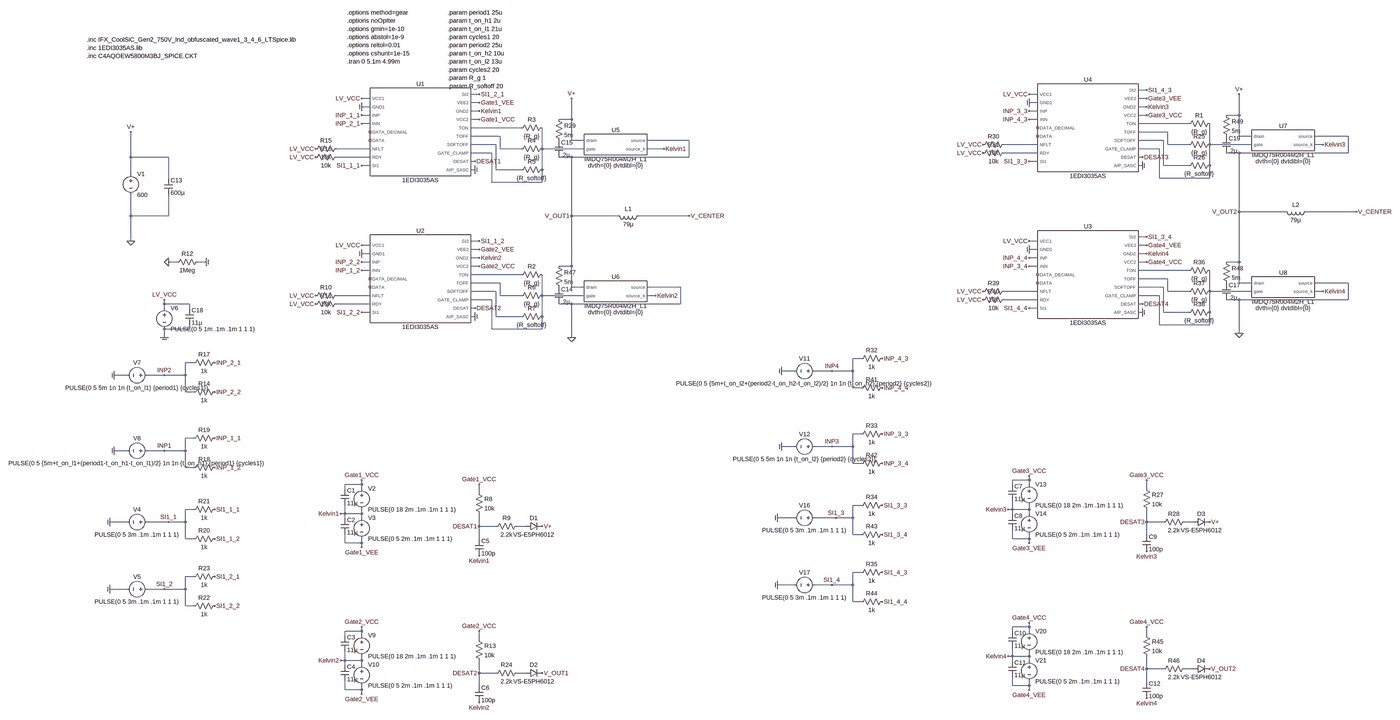
[diagram p0: schematic Dual Half Bridge Sim.asc, whole sheet]
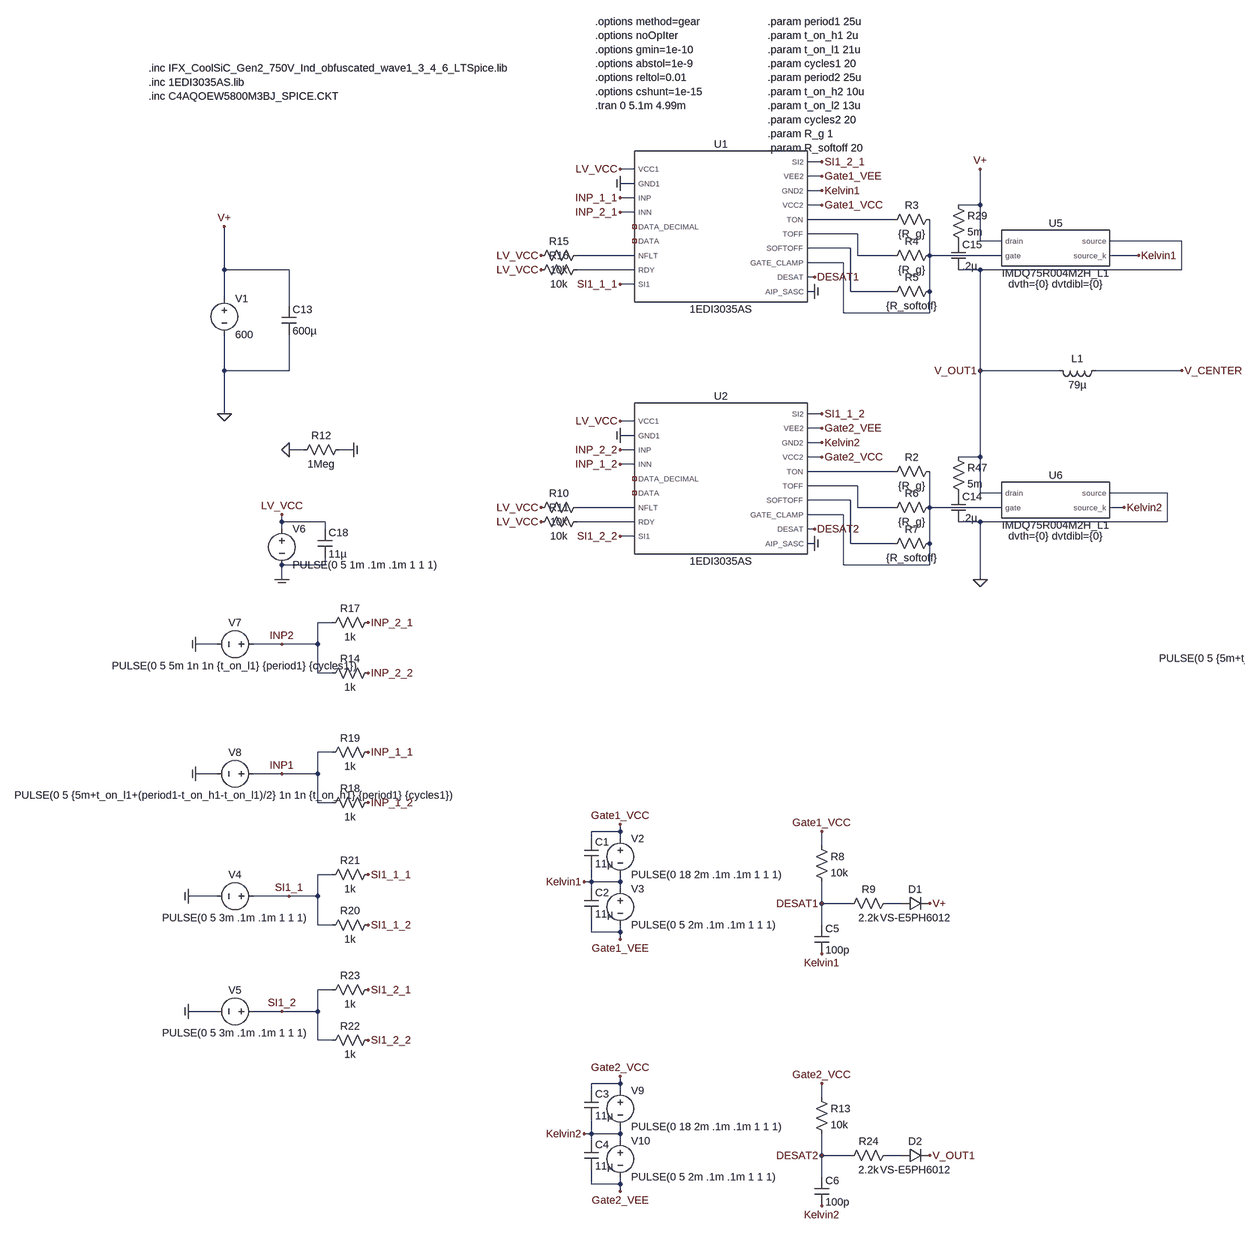
[diagram p1: schematic Dual Half Bridge Sim.asc, part, row 1 of 1, column 1 of 2]
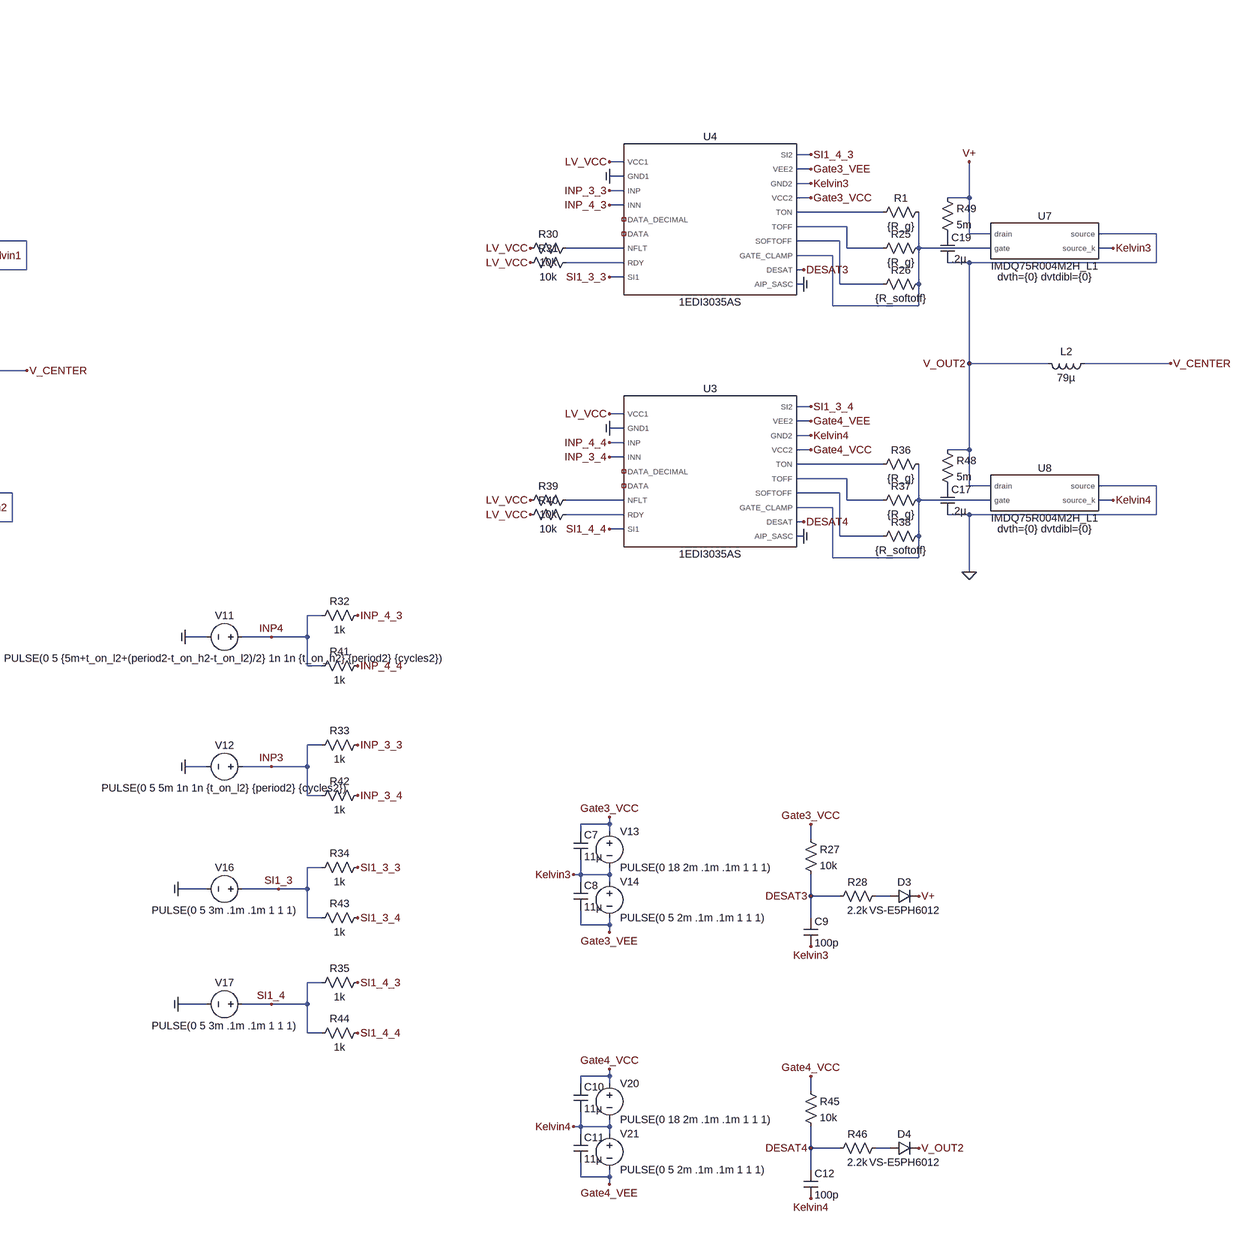
[diagram p2: schematic Dual Half Bridge Sim.asc, part, row 1 of 1, column 2 of 2]
Dual Half Bridge Sim.asc, the LTspice schematic file:
Version 4.1
SHEET 1 4068 2412
WIRE 3040 -64 3008 -64
WIRE 496 -48 464 -48
WIRE 2624 -48 2592 -48
WIRE 80 -32 48 -32
WIRE 3040 -32 3008 -32
WIRE 496 -16 464 -16
WIRE 2624 -16 2592 -16
WIRE 80 0 48 0
WIRE 3040 0 3008 0
WIRE 496 16 464 16
WIRE 2624 16 2592 16
WIRE 80 32 48 32
WIRE 3040 32 3008 32
WIRE 3392 32 3392 -48
WIRE 3392 32 3344 32
WIRE 496 48 464 48
WIRE 848 48 848 -32
WIRE 848 48 800 48
WIRE 2624 48 2592 48
WIRE 80 64 48 64
WIRE 3200 64 3008 64
WIRE 656 80 464 80
WIRE 3120 96 3008 96
WIRE 576 112 464 112
WIRE 3392 112 3392 32
WIRE 3440 112 3392 112
WIRE 3808 112 3680 112
WIRE 848 128 848 48
WIRE 896 128 848 128
WIRE 1296 128 1136 128
WIRE 3104 128 3008 128
WIRE 560 144 464 144
WIRE 2624 144 2496 144
WIRE 3120 144 3120 96
WIRE 3200 144 3120 144
WIRE 3280 144 3280 64
WIRE 3440 144 3280 144
WIRE 3712 144 3680 144
WIRE 80 160 -48 160
WIRE 576 160 576 112
WIRE 656 160 576 160
WIRE 736 160 736 80
WIRE 896 160 736 160
WIRE 1200 160 1136 160
WIRE 3088 160 3008 160
WIRE 544 176 464 176
WIRE 2624 176 2496 176
WIRE 3392 176 3344 176
WIRE 3808 176 3808 112
WIRE 3808 176 3392 176
WIRE -832 192 -832 96
WIRE -688 192 -832 192
WIRE 80 192 -48 192
WIRE 848 192 800 192
WIRE 1296 192 1296 128
WIRE 1296 192 848 192
WIRE 3024 192 3008 192
WIRE 480 208 464 208
WIRE 2624 208 2592 208
WIRE 80 224 48 224
WIRE 3024 224 3008 224
WIRE 3104 224 3104 128
WIRE 3200 224 3104 224
WIRE 3280 224 3280 144
WIRE 480 240 464 240
WIRE 560 240 560 144
WIRE 656 240 560 240
WIRE 736 240 736 160
WIRE -832 256 -832 192
WIRE -688 272 -688 192
WIRE 3088 272 3088 160
WIRE 3280 272 3280 224
WIRE 3280 272 3088 272
WIRE 544 288 544 176
WIRE 736 288 736 240
WIRE 736 288 544 288
WIRE 3392 400 3392 176
WIRE 3568 400 3392 400
WIRE 3840 400 3648 400
WIRE -832 416 -832 336
WIRE -688 416 -688 336
WIRE -688 416 -832 416
WIRE 848 416 848 192
WIRE 1024 416 848 416
WIRE 1296 416 1104 416
WIRE 3040 496 3008 496
WIRE -832 512 -832 416
WIRE 496 512 464 512
WIRE 2624 512 2592 512
WIRE 80 528 48 528
WIRE 3040 528 3008 528
WIRE 496 544 464 544
WIRE 2624 544 2592 544
WIRE 80 560 48 560
WIRE 3040 560 3008 560
WIRE 496 576 464 576
WIRE 2624 576 2592 576
WIRE -656 592 -688 592
WIRE -544 592 -576 592
WIRE 80 592 48 592
WIRE 3040 592 3008 592
WIRE 3392 592 3392 400
WIRE 3392 592 3344 592
WIRE 496 608 464 608
WIRE 848 608 848 416
WIRE 848 608 800 608
WIRE 2624 608 2592 608
WIRE 80 624 48 624
WIRE 3200 624 3008 624
WIRE 656 640 464 640
WIRE 3120 656 3008 656
WIRE 576 672 464 672
WIRE 3392 672 3392 592
WIRE 3440 672 3392 672
WIRE 3808 672 3680 672
WIRE 848 688 848 608
WIRE 896 688 848 688
WIRE 1264 688 1136 688
WIRE 3104 688 3008 688
WIRE 560 704 464 704
WIRE 2624 704 2496 704
WIRE 3120 704 3120 656
WIRE 3200 704 3120 704
WIRE 3280 704 3280 624
WIRE 3440 704 3280 704
WIRE 3712 704 3680 704
WIRE 80 720 -48 720
WIRE 576 720 576 672
WIRE 656 720 576 720
WIRE 736 720 736 640
WIRE 896 720 736 720
WIRE 1168 720 1136 720
WIRE 3088 720 3008 720
WIRE 544 736 464 736
WIRE 2624 736 2496 736
WIRE 3392 736 3344 736
WIRE 3808 736 3808 672
WIRE 3808 736 3392 736
WIRE -704 752 -704 736
WIRE -608 752 -704 752
WIRE 80 752 -48 752
WIRE 848 752 800 752
WIRE 1264 752 1264 688
WIRE 1264 752 848 752
WIRE 3024 752 3008 752
WIRE -704 768 -704 752
WIRE -608 768 -608 752
WIRE 480 768 464 768
WIRE 2624 768 2592 768
WIRE 80 784 48 784
WIRE 3024 784 3008 784
WIRE 3104 784 3104 688
WIRE 3200 784 3104 784
WIRE 3280 784 3280 704
WIRE 480 800 464 800
WIRE 560 800 560 704
WIRE 656 800 560 800
WIRE 736 800 736 720
WIRE 3088 832 3088 720
WIRE 3280 832 3280 784
WIRE 3280 832 3088 832
WIRE -608 848 -608 832
WIRE -608 848 -704 848
WIRE 544 848 544 736
WIRE 736 848 736 800
WIRE 736 848 544 848
WIRE 3392 864 3392 736
WIRE -704 880 -704 848
WIRE 848 880 848 752
WIRE 1952 960 1920 960
WIRE -592 976 -624 976
WIRE 1696 1008 1648 1008
WIRE 1840 1008 1776 1008
WIRE 1920 1008 1920 960
WIRE 1920 1008 1840 1008
WIRE -848 1024 -896 1024
WIRE -704 1024 -768 1024
WIRE -624 1024 -624 976
WIRE -624 1024 -704 1024
WIRE 1920 1072 1920 1008
WIRE 1952 1072 1920 1072
WIRE -624 1088 -624 1024
WIRE -592 1088 -624 1088
WIRE 1952 1248 1920 1248
WIRE -592 1264 -624 1264
WIRE 1696 1296 1648 1296
WIRE 1840 1296 1776 1296
WIRE 1920 1296 1920 1248
WIRE 1920 1296 1840 1296
WIRE -848 1312 -896 1312
WIRE -704 1312 -768 1312
WIRE -624 1312 -624 1264
WIRE -624 1312 -704 1312
WIRE 1920 1360 1920 1296
WIRE 1952 1360 1920 1360
WIRE -624 1376 -624 1312
WIRE -592 1376 -624 1376
WIRE 2592 1424 2592 1408
WIRE 2592 1424 2528 1424
WIRE 48 1440 48 1424
WIRE 48 1440 -16 1440
WIRE 2528 1440 2528 1424
WIRE 2592 1440 2592 1424
WIRE -16 1456 -16 1440
WIRE 48 1456 48 1440
WIRE 3040 1456 3040 1424
WIRE 496 1472 496 1440
WIRE 1952 1520 1920 1520
WIRE -592 1536 -624 1536
WIRE 2528 1536 2528 1504
WIRE 2528 1536 2512 1536
WIRE 2592 1536 2592 1520
WIRE 2592 1536 2528 1536
WIRE -16 1552 -16 1520
WIRE -16 1552 -32 1552
WIRE 48 1552 48 1536
WIRE 48 1552 -16 1552
WIRE 2528 1552 2528 1536
WIRE 2592 1552 2592 1536
WIRE -16 1568 -16 1552
WIRE 48 1568 48 1552
WIRE 1696 1568 1632 1568
WIRE 1856 1568 1776 1568
WIRE 1920 1568 1920 1520
WIRE 1920 1568 1856 1568
WIRE -848 1584 -912 1584
WIRE -688 1584 -768 1584
WIRE -624 1584 -624 1536
WIRE -624 1584 -688 1584
WIRE 3040 1584 3040 1536
WIRE 3104 1584 3040 1584
WIRE 3216 1584 3184 1584
WIRE 496 1600 496 1552
WIRE 560 1600 496 1600
WIRE 672 1600 640 1600
WIRE 1920 1632 1920 1568
WIRE 1952 1632 1920 1632
WIRE 3040 1632 3040 1584
WIRE -624 1648 -624 1584
WIRE -592 1648 -624 1648
WIRE 496 1648 496 1600
WIRE 2528 1648 2528 1616
WIRE 2592 1648 2592 1632
WIRE 2592 1648 2528 1648
WIRE -16 1664 -16 1632
WIRE 48 1664 48 1648
WIRE 48 1664 -16 1664
WIRE 2592 1664 2592 1648
WIRE 48 1680 48 1664
WIRE 1952 1776 1920 1776
WIRE -592 1792 -624 1792
WIRE 1696 1824 1632 1824
WIRE 1840 1824 1776 1824
WIRE 1920 1824 1920 1776
WIRE 1920 1824 1840 1824
WIRE -848 1840 -912 1840
WIRE -704 1840 -768 1840
WIRE -624 1840 -624 1792
WIRE -624 1840 -704 1840
WIRE 1920 1888 1920 1824
WIRE 1952 1888 1920 1888
WIRE -624 1904 -624 1840
WIRE -592 1904 -624 1904
WIRE 2592 1984 2592 1968
WIRE 2592 1984 2528 1984
WIRE 48 2000 48 1984
WIRE 48 2000 -16 2000
WIRE 2528 2000 2528 1984
WIRE 2592 2000 2592 1984
WIRE -16 2016 -16 2000
WIRE 48 2016 48 2000
WIRE 3040 2016 3040 1984
WIRE 496 2032 496 2000
WIRE 2528 2096 2528 2064
WIRE 2528 2096 2512 2096
WIRE 2592 2096 2592 2080
WIRE 2592 2096 2528 2096
WIRE -16 2112 -16 2080
WIRE -16 2112 -32 2112
WIRE 48 2112 48 2096
WIRE 48 2112 -16 2112
WIRE 2528 2112 2528 2096
WIRE 2592 2112 2592 2096
WIRE -16 2128 -16 2112
WIRE 48 2128 48 2112
WIRE 3040 2144 3040 2096
WIRE 3104 2144 3040 2144
WIRE 3216 2144 3184 2144
WIRE 496 2160 496 2112
WIRE 560 2160 496 2160
WIRE 672 2160 640 2160
WIRE 3040 2192 3040 2144
WIRE 496 2208 496 2160
WIRE 2528 2208 2528 2176
WIRE 2592 2208 2592 2192
WIRE 2592 2208 2528 2208
WIRE -16 2224 -16 2192
WIRE 48 2224 48 2208
WIRE 48 2224 -16 2224
WIRE 2592 2224 2592 2208
WIRE 48 2240 48 2224
FLAG -832 512 0
FLAG 848 -32 V+
FLAG 48 32 INP_1_1
FLAG 48 64 INP_2_1
FLAG 48 224 SI1_1_1
FLAG 496 -48 SI1_2_1
FLAG 496 16 Kelvin1
FLAG 496 48 Gate1_VCC
FLAG 496 -16 Gate1_VEE
FLAG -32 1552 Kelvin1
FLAG 48 1424 Gate1_VCC
FLAG 48 1680 Gate1_VEE
FLAG 496 1440 Gate1_VCC
FLAG 496 1712 Kelvin1
FLAG 736 1600 V+
FLAG 480 208 DESAT1
FLAG 496 1600 DESAT1
FLAG 848 416 V_OUT1
FLAG 48 0 COM
FLAG -688 592 0
FLAG -544 592 COM
FLAG 48 -32 LV_VCC
FLAG -704 736 LV_VCC
FLAG -704 880 COM
FLAG -128 160 LV_VCC
FLAG -128 192 LV_VCC
FLAG -512 1536 SI1_1_1
FLAG -512 1792 SI1_2_1
FLAG -704 1024 INP2
FLAG -704 1312 INP1
FLAG -688 1584 SI1_1
FLAG -704 1840 SI1_2
FLAG -832 96 V+
FLAG -912 1584 COM
FLAG -912 1840 COM
FLAG 480 240 COM
FLAG -896 1024 COM
FLAG -896 1312 COM
FLAG 48 592 INP_2_2
FLAG 48 624 INP_1_2
FLAG 48 784 SI1_2_2
FLAG 496 512 SI1_1_2
FLAG 496 576 Kelvin2
FLAG 496 608 Gate2_VCC
FLAG 496 544 Gate2_VEE
FLAG 480 768 DESAT2
FLAG 48 560 COM
FLAG 48 528 LV_VCC
FLAG -128 720 LV_VCC
FLAG -128 752 LV_VCC
FLAG 480 800 COM
FLAG -512 976 INP_2_1
FLAG -512 1088 INP_2_2
FLAG -512 1264 INP_1_1
FLAG -512 1376 INP_1_2
FLAG -512 1648 SI1_1_2
FLAG -512 1904 SI1_2_2
FLAG -32 2112 Kelvin2
FLAG 48 1984 Gate2_VCC
FLAG 48 2240 Gate2_VEE
FLAG 496 2000 Gate2_VCC
FLAG 496 2272 Kelvin2
FLAG 736 2160 V_OUT1
FLAG 496 2160 DESAT2
FLAG 848 880 0
FLAG 3392 -48 V+
FLAG 2592 16 INP_3_3
FLAG 2592 48 INP_4_3
FLAG 2592 208 SI1_3_3
FLAG 3040 -64 SI1_4_3
FLAG 3712 144 Kelvin3
FLAG 3040 0 Kelvin3
FLAG 3040 32 Gate3_VCC
FLAG 3040 -32 Gate3_VEE
FLAG 2512 1536 Kelvin3
FLAG 2592 1408 Gate3_VCC
FLAG 2592 1664 Gate3_VEE
FLAG 3040 1424 Gate3_VCC
FLAG 3040 1696 Kelvin3
FLAG 3280 1584 V+
FLAG 3024 192 DESAT3
FLAG 3040 1584 DESAT3
FLAG 3392 400 V_OUT2
FLAG 2592 -16 COM
FLAG 2592 -48 LV_VCC
FLAG 2416 144 LV_VCC
FLAG 2416 176 LV_VCC
FLAG 2032 1520 SI1_3_3
FLAG 2032 1776 SI1_4_3
FLAG 1840 1008 INP4
FLAG 1840 1296 INP3
FLAG 1856 1568 SI1_3
FLAG 1840 1824 SI1_4
FLAG 1632 1568 COM
FLAG 1632 1824 COM
FLAG 3024 224 COM
FLAG 1648 1008 COM
FLAG 1648 1296 COM
FLAG 2592 576 INP_4_4
FLAG 2592 608 INP_3_4
FLAG 2592 768 SI1_4_4
FLAG 3040 496 SI1_3_4
FLAG 3712 704 Kelvin4
FLAG 3040 560 Kelvin4
FLAG 3040 592 Gate4_VCC
FLAG 3040 528 Gate4_VEE
FLAG 3024 752 DESAT4
FLAG 2592 544 COM
FLAG 2592 512 LV_VCC
FLAG 2416 704 LV_VCC
FLAG 2416 736 LV_VCC
FLAG 3024 784 COM
FLAG 2032 960 INP_4_3
FLAG 2032 1072 INP_4_4
FLAG 2032 1248 INP_3_3
FLAG 2032 1360 INP_3_4
FLAG 2032 1632 SI1_3_4
FLAG 2032 1888 SI1_4_4
FLAG 2512 2096 Kelvin4
FLAG 2592 1968 Gate4_VCC
FLAG 2592 2224 Gate4_VEE
FLAG 3040 1984 Gate4_VCC
FLAG 3040 2256 Kelvin4
FLAG 3280 2144 V_OUT2
FLAG 3040 2144 DESAT4
FLAG 3392 864 0
FLAG 3840 400 V_CENTER
FLAG 1296 416 V_CENTER
FLAG 1200 160 Kelvin1
FLAG 1168 720 Kelvin2
SYMBOL voltage -832 240 R0
WINDOW 123 0 0 Left 0
SYMATTR InstName V1
SYMATTR Value 600
SYMATTR SpiceLine Rser=.1 Cpar=1n
SYMBOL voltage 48 1440 R0
WINDOW 123 0 0 Left 0
SYMATTR InstName V2
SYMATTR Value PULSE(0 18 2m .1m .1m 1 1 1)
SYMATTR SpiceLine Rser=.1 Cpar=1n
SYMBOL voltage 48 1552 R0
WINDOW 123 0 0 Left 0
SYMATTR InstName V3
SYMATTR Value PULSE(0 5 2m .1m .1m 1 1 1)
SYMATTR SpiceLine Rser=.1 Cpar=1n
SYMBOL Res 752 64 R90
WINDOW 0 0 56 VBottom 2
WINDOW 3 32 56 VTop 2
SYMATTR InstName R3
SYMATTR Value {R_g}
SYMBOL Res 752 144 R90
WINDOW 0 0 56 VBottom 2
WINDOW 3 32 56 VTop 2
SYMATTR InstName R4
SYMATTR Value {R_g}
SYMBOL Res 752 224 R90
WINDOW 0 0 56 VBottom 2
WINDOW 3 32 56 VTop 2
SYMATTR InstName R5
SYMATTR Value {R_softoff}
SYMBOL cap -32 1456 R0
SYMATTR InstName C1
SYMATTR Value 11µ
SYMATTR SpiceLine Rser=10m
SYMBOL cap -32 1568 R0
SYMATTR InstName C2
SYMATTR Value 11µ
SYMATTR SpiceLine Rser=10m
SYMBOL res 480 1456 R0
SYMATTR InstName R8
SYMATTR Value 10k
SYMBOL res 656 1584 R90
WINDOW 0 0 56 VBottom 2
WINDOW 3 32 56 VTop 2
SYMATTR InstName R9
SYMATTR Value 2.2k
SYMBOL cap 480 1648 R0
SYMATTR InstName C5
SYMATTR Value 100p
SYMATTR SpiceLine Rser=10m
SYMBOL diode 672 1616 R270
WINDOW 0 32 32 VTop 2
WINDOW 3 0 32 VBottom 2
SYMATTR InstName D1
SYMATTR Value VS-E5PH6012
SYMBOL res -560 576 R90
WINDOW 0 0 56 VBottom 2
WINDOW 3 32 56 VTop 2
SYMATTR InstName R12
SYMATTR Value 1Meg
SYMBOL voltage -704 752 R0
WINDOW 123 0 0 Left 0
SYMATTR InstName V6
SYMATTR Value PULSE(0 5 1m .1m .1m 1 1 1)
SYMATTR SpiceLine Rser=.1 Cpar=1n
SYMBOL res -32 144 R90
WINDOW 0 0 56 VBottom 2
WINDOW 3 32 56 VTop 2
SYMATTR InstName R15
SYMATTR Value 10k
SYMBOL res -32 176 R90
WINDOW 0 0 56 VBottom 2
WINDOW 3 32 56 VTop 2
SYMATTR InstName R16
SYMATTR Value 10k
SYMBOL res -496 960 R90
WINDOW 0 0 56 VBottom 2
WINDOW 3 32 56 VTop 2
SYMATTR InstName R17
SYMATTR Value 1k
SYMBOL res -496 1248 R90
WINDOW 0 0 56 VBottom 2
WINDOW 3 32 56 VTop 2
SYMATTR InstName R19
SYMATTR Value 1k
SYMBOL res -496 1520 R90
WINDOW 0 0 56 VBottom 2
WINDOW 3 32 56 VTop 2
SYMATTR InstName R21
SYMATTR Value 1k
SYMBOL res -496 1776 R90
WINDOW 0 0 56 VBottom 2
WINDOW 3 32 56 VTop 2
SYMATTR InstName R23
SYMATTR Value 1k
SYMBOL voltage -752 1584 R90
WINDOW 0 -32 56 VBottom 2
WINDOW 3 32 56 VTop 2
WINDOW 123 0 0 Left 0
SYMATTR InstName V4
SYMATTR Value PULSE(0 5 3m .1m .1m 1 1 1)
SYMATTR SpiceLine Rser=.1 Cpar=1n
SYMBOL voltage -752 1840 R90
WINDOW 0 -32 56 VBottom 2
WINDOW 3 32 56 VTop 2
WINDOW 123 0 0 Left 0
SYMATTR InstName V5
SYMATTR Value PULSE(0 5 3m .1m .1m 1 1 1)
SYMATTR SpiceLine Rser=.1 Cpar=1n
SYMBOL voltage -752 1024 R90
WINDOW 0 -32 56 VBottom 2
WINDOW 3 32 56 VTop 2
WINDOW 123 0 0 Left 0
SYMATTR InstName V7
SYMATTR Value PULSE(0 5 5m 1n 1n {t_on_l1} {period1} {cycles1})
SYMATTR SpiceLine Rser=.1 Cpar=1n
SYMBOL voltage -752 1312 R90
WINDOW 0 -32 56 VBottom 2
WINDOW 3 32 56 VTop 2
WINDOW 123 0 0 Left 0
SYMATTR InstName V8
SYMATTR Value PULSE(0 5 {5m+t_on_l1+(period1-t_on_h1-t_on_l1)/2} 1n 1n {t_on_h1} {period1} {cycles1})
SYMATTR SpiceLine Rser=.1 Cpar=1n
SYMBOL Res 752 624 R90
WINDOW 0 0 56 VBottom 2
WINDOW 3 32 56 VTop 2
SYMATTR InstName R2
SYMATTR Value {R_g}
SYMBOL Res 752 704 R90
WINDOW 0 0 56 VBottom 2
WINDOW 3 32 56 VTop 2
SYMATTR InstName R6
SYMATTR Value {R_g}
SYMBOL Res 752 784 R90
WINDOW 0 0 56 VBottom 2
WINDOW 3 32 56 VTop 2
SYMATTR InstName R7
SYMATTR Value {R_softoff}
SYMBOL res -32 704 R90
WINDOW 0 0 56 VBottom 2
WINDOW 3 32 56 VTop 2
SYMATTR InstName R10
SYMATTR Value 10k
SYMBOL res -32 736 R90
WINDOW 0 0 56 VBottom 2
WINDOW 3 32 56 VTop 2
SYMATTR InstName R11
SYMATTR Value 10k
SYMBOL res -496 1072 R90
WINDOW 0 0 56 VBottom 2
WINDOW 3 32 56 VTop 2
SYMATTR InstName R14
SYMATTR Value 1k
SYMBOL res -496 1360 R90
WINDOW 0 0 56 VBottom 2
WINDOW 3 32 56 VTop 2
SYMATTR InstName R18
SYMATTR Value 1k
SYMBOL res -496 1632 R90
WINDOW 0 0 56 VBottom 2
WINDOW 3 32 56 VTop 2
SYMATTR InstName R20
SYMATTR Value 1k
SYMBOL res -496 1888 R90
WINDOW 0 0 56 VBottom 2
WINDOW 3 32 56 VTop 2
SYMATTR InstName R22
SYMATTR Value 1k
SYMBOL voltage 48 2000 R0
WINDOW 123 0 0 Left 0
SYMATTR InstName V9
SYMATTR Value PULSE(0 18 2m .1m .1m 1 1 1)
SYMATTR SpiceLine Rser=.1 Cpar=1n
SYMBOL voltage 48 2112 R0
WINDOW 123 0 0 Left 0
SYMATTR InstName V10
SYMATTR Value PULSE(0 5 2m .1m .1m 1 1 1)
SYMATTR SpiceLine Rser=.1 Cpar=1n
SYMBOL cap -32 2016 R0
SYMATTR InstName C3
SYMATTR Value 11µ
SYMATTR SpiceLine Rser=10m
SYMBOL cap -32 2128 R0
SYMATTR InstName C4
SYMATTR Value 11µ
SYMATTR SpiceLine Rser=10m
SYMBOL res 480 2016 R0
SYMATTR InstName R13
SYMATTR Value 10k
SYMBOL res 656 2144 R90
WINDOW 0 0 56 VBottom 2
WINDOW 3 32 56 VTop 2
SYMATTR InstName R24
SYMATTR Value 2.2k
SYMBOL cap 480 2208 R0
SYMATTR InstName C6
SYMATTR Value 100p
SYMATTR SpiceLine Rser=10m
SYMBOL diode 672 2176 R270
WINDOW 0 32 32 VTop 2
WINDOW 3 0 32 VBottom 2
SYMATTR InstName D2
SYMATTR Value VS-E5PH6012
SYMBOL ind 1120 400 R90
WINDOW 0 5 56 VBottom 2
WINDOW 3 32 56 VTop 2
SYMATTR InstName L1
SYMATTR Value 79µ
SYMATTR SpiceLine Rser=10m
SYMBOL voltage 2592 1424 R0
WINDOW 123 0 0 Left 0
SYMATTR InstName V13
SYMATTR Value PULSE(0 18 2m .1m .1m 1 1 1)
SYMATTR SpiceLine Rser=.1 Cpar=1n
SYMBOL voltage 2592 1536 R0
WINDOW 123 0 0 Left 0
SYMATTR InstName V14
SYMATTR Value PULSE(0 5 2m .1m .1m 1 1 1)
SYMATTR SpiceLine Rser=.1 Cpar=1n
SYMBOL Res 3296 48 R90
WINDOW 0 0 56 VBottom 2
WINDOW 3 32 56 VTop 2
SYMATTR InstName R1
SYMATTR Value {R_g}
SYMBOL Res 3296 128 R90
WINDOW 0 0 56 VBottom 2
WINDOW 3 32 56 VTop 2
SYMATTR InstName R25
SYMATTR Value {R_g}
SYMBOL Res 3296 208 R90
WINDOW 0 0 56 VBottom 2
WINDOW 3 32 56 VTop 2
SYMATTR InstName R26
SYMATTR Value {R_softoff}
SYMBOL cap 2512 1440 R0
SYMATTR InstName C7
SYMATTR Value 11µ
SYMATTR SpiceLine Rser=10m
SYMBOL cap 2512 1552 R0
SYMATTR InstName C8
SYMATTR Value 11µ
SYMATTR SpiceLine Rser=10m
SYMBOL res 3024 1440 R0
SYMATTR InstName R27
SYMATTR Value 10k
SYMBOL res 3200 1568 R90
WINDOW 0 0 56 VBottom 2
WINDOW 3 32 56 VTop 2
SYMATTR InstName R28
SYMATTR Value 2.2k
SYMBOL cap 3024 1632 R0
SYMATTR InstName C9
SYMATTR Value 100p
SYMATTR SpiceLine Rser=10m
SYMBOL diode 3216 1600 R270
WINDOW 0 32 32 VTop 2
WINDOW 3 0 32 VBottom 2
SYMATTR InstName D3
SYMATTR Value VS-E5PH6012
SYMBOL res 2512 128 R90
WINDOW 0 0 56 VBottom 2
WINDOW 3 32 56 VTop 2
SYMATTR InstName R30
SYMATTR Value 10k
SYMBOL res 2512 160 R90
WINDOW 0 0 56 VBottom 2
WINDOW 3 32 56 VTop 2
SYMATTR InstName R31
SYMATTR Value 10k
SYMBOL res 2048 944 R90
WINDOW 0 0 56 VBottom 2
WINDOW 3 32 56 VTop 2
SYMATTR InstName R32
SYMATTR Value 1k
SYMBOL res 2048 1232 R90
WINDOW 0 0 56 VBottom 2
WINDOW 3 32 56 VTop 2
SYMATTR InstName R33
SYMATTR Value 1k
SYMBOL res 2048 1504 R90
WINDOW 0 0 56 VBottom 2
WINDOW 3 32 56 VTop 2
SYMATTR InstName R34
SYMATTR Value 1k
SYMBOL res 2048 1760 R90
WINDOW 0 0 56 VBottom 2
WINDOW 3 32 56 VTop 2
SYMATTR InstName R35
SYMATTR Value 1k
SYMBOL voltage 1792 1568 R90
WINDOW 0 -32 56 VBottom 2
WINDOW 3 32 56 VTop 2
WINDOW 123 0 0 Left 0
SYMATTR InstName V16
SYMATTR Value PULSE(0 5 3m .1m .1m 1 1 1)
SYMATTR SpiceLine Rser=.1 Cpar=1n
SYMBOL voltage 1792 1824 R90
WINDOW 0 -32 56 VBottom 2
WINDOW 3 32 56 VTop 2
WINDOW 123 0 0 Left 0
SYMATTR InstName V17
SYMATTR Value PULSE(0 5 3m .1m .1m 1 1 1)
SYMATTR SpiceLine Rser=.1 Cpar=1n
SYMBOL Res 3296 608 R90
WINDOW 0 0 56 VBottom 2
WINDOW 3 32 56 VTop 2
SYMATTR InstName R36
SYMATTR Value {R_g}
SYMBOL Res 3296 688 R90
WINDOW 0 0 56 VBottom 2
WINDOW 3 32 56 VTop 2
SYMATTR InstName R37
SYMATTR Value {R_g}
SYMBOL Res 3296 768 R90
WINDOW 0 0 56 VBottom 2
WINDOW 3 32 56 VTop 2
SYMATTR InstName R38
SYMATTR Value {R_softoff}
SYMBOL res 2512 688 R90
WINDOW 0 0 56 VBottom 2
WINDOW 3 32 56 VTop 2
SYMATTR InstName R39
SYMATTR Value 10k
SYMBOL res 2512 720 R90
WINDOW 0 0 56 VBottom 2
WINDOW 3 32 56 VTop 2
SYMATTR InstName R40
SYMATTR Value 10k
SYMBOL res 2048 1056 R90
WINDOW 0 0 56 VBottom 2
WINDOW 3 32 56 VTop 2
SYMATTR InstName R41
SYMATTR Value 1k
SYMBOL res 2048 1344 R90
WINDOW 0 0 56 VBottom 2
WINDOW 3 32 56 VTop 2
SYMATTR InstName R42
SYMATTR Value 1k
SYMBOL res 2048 1616 R90
WINDOW 0 0 56 VBottom 2
WINDOW 3 32 56 VTop 2
SYMATTR InstName R43
SYMATTR Value 1k
SYMBOL res 2048 1872 R90
WINDOW 0 0 56 VBottom 2
WINDOW 3 32 56 VTop 2
SYMATTR InstName R44
SYMATTR Value 1k
SYMBOL voltage 2592 1984 R0
WINDOW 123 0 0 Left 0
SYMATTR InstName V20
SYMATTR Value PULSE(0 18 2m .1m .1m 1 1 1)
SYMATTR SpiceLine Rser=.1 Cpar=1n
SYMBOL voltage 2592 2096 R0
WINDOW 123 0 0 Left 0
SYMATTR InstName V21
SYMATTR Value PULSE(0 5 2m .1m .1m 1 1 1)
SYMATTR SpiceLine Rser=.1 Cpar=1n
SYMBOL cap 2512 2000 R0
SYMATTR InstName C10
SYMATTR Value 11µ
SYMATTR SpiceLine Rser=10m
SYMBOL cap 2512 2112 R0
SYMATTR InstName C11
SYMATTR Value 11µ
SYMATTR SpiceLine Rser=10m
SYMBOL res 3024 2000 R0
SYMATTR InstName R45
SYMATTR Value 10k
SYMBOL res 3200 2128 R90
WINDOW 0 0 56 VBottom 2
WINDOW 3 32 56 VTop 2
SYMATTR InstName R46
SYMATTR Value 2.2k
SYMBOL cap 3024 2192 R0
SYMATTR InstName C12
SYMATTR Value 100p
SYMATTR SpiceLine Rser=10m
SYMBOL diode 3216 2160 R270
WINDOW 0 32 32 VTop 2
WINDOW 3 0 32 VBottom 2
SYMATTR InstName D4
SYMATTR Value VS-E5PH6012
SYMBOL ind 3664 384 R90
WINDOW 0 5 56 VBottom 2
WINDOW 3 32 56 VTop 2
SYMATTR InstName L2
SYMATTR Value 79µ
SYMATTR SpiceLine Rser=10m
SYMBOL cap -704 272 R0
SYMATTR InstName C13
SYMATTR Value 600µ
SYMBOL voltage 1792 1008 R90
WINDOW 0 -32 56 VBottom 2
WINDOW 3 32 56 VTop 2
WINDOW 123 0 0 Left 0
SYMATTR InstName V11
SYMATTR Value PULSE(0 5 {5m+t_on_l2+(period2-t_on_h2-t_on_l2)/2} 1n 1n {t_on_h2} {period2} {cycles2})
SYMATTR SpiceLine Rser=.1 Cpar=1n
SYMBOL voltage 1792 1296 R90
WINDOW 0 -32 56 VBottom 2
WINDOW 3 32 56 VTop 2
WINDOW 123 0 0 Left 0
SYMATTR InstName V12
SYMATTR Value PULSE(0 5 5m 1n 1n {t_on_l2} {period2} {cycles2})
SYMATTR SpiceLine Rser=.1 Cpar=1n
SYMBOL cap -624 768 R0
SYMATTR InstName C18
SYMATTR Value 11µ
SYMATTR SpiceLine Rser=.005
SYMBOL 1EDI3035AS 272 96 R0
SYMATTR InstName U1
SYMBOL 1EDI3035AS 272 656 R0
SYMATTR InstName U2
SYMBOL 1EDI3035AS 2816 640 R0
SYMATTR InstName U3
SYMBOL 1EDI3035AS 2816 80 R0
SYMATTR InstName U4
SYMBOL IMDQ75R004M2H_L1 1008 144 R0
SYMATTR InstName U5
SYMBOL IMDQ75R004M2H_L1 1008 704 R0
SYMATTR InstName U6
SYMBOL IMDQ75R004M2H_L1 3552 128 R0
SYMATTR InstName U7
SYMBOL IMDQ75R004M2H_L1 3552 688 R0
SYMATTR InstName U8
SYMBOL res 784 32 R0
SYMATTR InstName R29
SYMATTR Value 5m
SYMBOL cap 784 128 R0
SYMATTR InstName C15
SYMATTR Value .2µ
SYMBOL res 784 592 R0
SYMATTR InstName R47
SYMATTR Value 5m
SYMBOL cap 784 688 R0
SYMATTR InstName C14
SYMATTR Value .2µ
SYMBOL res 3328 576 R0
SYMATTR InstName R48
SYMATTR Value 5m
SYMBOL cap 3328 672 R0
SYMATTR InstName C17
SYMATTR Value .2µ
SYMBOL res 3328 16 R0
SYMATTR InstName R49
SYMATTR Value 5m
SYMBOL cap 3328 112 R0
SYMATTR InstName C19
SYMATTR Value .2µ
TEXT -8 -360 Left 2 !.options method=gear\n.options noOpIter\n.options gmin=1e-10\n.options abstol=1e-9\n.options reltol=0.01\n.options cshunt=1e-15\n.tran 0 5.1m 4.99m
TEXT -1000 -256 Left 2 !.inc IFX_CoolSiC_Gen2_750V_Ind_obfuscated_wave1_3_4_6_LTSpice.lib\n.inc 1EDI3035AS.lib\n.inc C4AQOEW5800M3BJ_SPICE.CKT
TEXT 376 -360 Left 2 !.param period1 25u\n.param t_on_h1 2u\n.param t_on_l1 21u\n.param cycles1 20\n.param period2 25u\n.param t_on_h2 10u\n.param t_on_l2 13u\n.param cycles2 20\n.param R_g 1\n.param R_softoff 20

The netlist it stands for:
* Dual Half Bridge Sim.asc
V1 V+ 0 600 Rser=.1 Cpar=1n
V2 Gate1_VCC Kelvin1 PULSE(0 18 2m .1m .1m 1 1 1) Rser=.1 Cpar=1n
V3 Kelvin1 Gate1_VEE PULSE(0 5 2m .1m .1m 1 1 1) Rser=.1 Cpar=1n
R3 N010 N002 {R_g}
R4 N010 N004 {R_g}
R5 N010 N006 {R_softoff}
C1 Gate1_VCC Kelvin1 11µ Rser=10m
C2 Kelvin1 Gate1_VEE 11µ Rser=10m
R8 Gate1_VCC DESAT1 10k
R9 N026 DESAT1 2.2k
C5 DESAT1 Kelvin1 100p Rser=10m
D1 N026 V+ VS-E5PH6012
R12 COM 0 1Meg
V6 LV_VCC COM PULSE(0 5 1m .1m .1m 1 1 1) Rser=.1 Cpar=1n
R15 N009 LV_VCC 10k
R16 N012 LV_VCC 10k
R17 INP_2_1 INP2 1k
R19 INP_1_1 INP1 1k
R21 SI1_1_1 SI1_1 1k
R23 SI1_2_1 SI1_2 1k
V4 SI1_1 COM PULSE(0 5 3m .1m .1m 1 1 1) Rser=.1 Cpar=1n
V5 SI1_2 COM PULSE(0 5 3m .1m .1m 1 1 1) Rser=.1 Cpar=1n
V7 INP2 COM PULSE(0 5 5m 1n 1n {t_on_l1} {period1} {cycles1}) Rser=.1 Cpar=1n
V8 INP1 COM PULSE(0 5 {5m+t_on_l1+(period1-t_on_h1-t_on_l1)/2} 1n 1n {t_on_h1} {period1} {cycles1}) Rser=.1 Cpar=1n
R2 N022 N014 {R_g}
R6 N022 N016 {R_g}
R7 N022 N018 {R_softoff}
R10 N021 LV_VCC 10k
R11 N024 LV_VCC 10k
R14 INP_2_2 INP2 1k
R18 INP_1_2 INP1 1k
R20 SI1_1_2 SI1_1 1k
R22 SI1_2_2 SI1_2 1k
V9 Gate2_VCC Kelvin2 PULSE(0 18 2m .1m .1m 1 1 1) Rser=.1 Cpar=1n
V10 Kelvin2 Gate2_VEE PULSE(0 5 2m .1m .1m 1 1 1) Rser=.1 Cpar=1n
C3 Gate2_VCC Kelvin2 11µ Rser=10m
C4 Kelvin2 Gate2_VEE 11µ Rser=10m
R13 Gate2_VCC DESAT2 10k
R24 N028 DESAT2 2.2k
C6 DESAT2 Kelvin2 100p Rser=10m
D2 N028 V_OUT1 VS-E5PH6012
L1 V_CENTER V_OUT1 79µ Rser=10m
V13 Gate3_VCC Kelvin3 PULSE(0 18 2m .1m .1m 1 1 1) Rser=.1 Cpar=1n
V14 Kelvin3 Gate3_VEE PULSE(0 5 2m .1m .1m 1 1 1) Rser=.1 Cpar=1n
R1 N008 N001 {R_g}
R25 N008 N003 {R_g}
R26 N008 N005 {R_softoff}
C7 Gate3_VCC Kelvin3 11µ Rser=10m
C8 Kelvin3 Gate3_VEE 11µ Rser=10m
R27 Gate3_VCC DESAT3 10k
R28 N025 DESAT3 2.2k
C9 DESAT3 Kelvin3 100p Rser=10m
D3 N025 V+ VS-E5PH6012
R30 N007 LV_VCC 10k
R31 N011 LV_VCC 10k
R32 INP_4_3 INP4 1k
R33 INP_3_3 INP3 1k
R34 SI1_3_3 SI1_3 1k
R35 SI1_4_3 SI1_4 1k
V16 SI1_3 COM PULSE(0 5 3m .1m .1m 1 1 1) Rser=.1 Cpar=1n
V17 SI1_4 COM PULSE(0 5 3m .1m .1m 1 1 1) Rser=.1 Cpar=1n
R36 N020 N013 {R_g}
R37 N020 N015 {R_g}
R38 N020 N017 {R_softoff}
R39 N019 LV_VCC 10k
R40 N023 LV_VCC 10k
R41 INP_4_4 INP4 1k
R42 INP_3_4 INP3 1k
R43 SI1_3_4 SI1_3 1k
R44 SI1_4_4 SI1_4 1k
V20 Gate4_VCC Kelvin4 PULSE(0 18 2m .1m .1m 1 1 1) Rser=.1 Cpar=1n
V21 Kelvin4 Gate4_VEE PULSE(0 5 2m .1m .1m 1 1 1) Rser=.1 Cpar=1n
C10 Gate4_VCC Kelvin4 11µ Rser=10m
C11 Kelvin4 Gate4_VEE 11µ Rser=10m
R45 Gate4_VCC DESAT4 10k
R46 N027 DESAT4 2.2k
C12 DESAT4 Kelvin4 100p Rser=10m
D4 N027 V_OUT2 VS-E5PH6012
L2 V_CENTER V_OUT2 79µ Rser=10m
C13 V+ 0 600µ
V11 INP4 COM PULSE(0 5 {5m+t_on_l2+(period2-t_on_h2-t_on_l2)/2} 1n 1n {t_on_h2} {period2} {cycles2}) Rser=.1 Cpar=1n
V12 INP3 COM PULSE(0 5 5m 1n 1n {t_on_l2} {period2} {cycles2}) Rser=.1 Cpar=1n
C18 LV_VCC COM 11µ Rser=.005
X§U1 LV_VCC COM INP_1_1 INP_2_1 NC_01 NC_02 N009 N012 SI1_1_1 SI1_2_1 Gate1_VEE Kelvin1 Gate1_VCC N002 N004 N006 N010 DESAT1 COM 1EDI3035AS  ; pins VCC1 GND1 INP INN DATA_DECIMAL DATA NFLT RDY SI1 SI2 VEE2 GND2 VCC2 TON TOFF SOFTOFF GATE_CLAMP DESAT AIP_SASC
X§U2 LV_VCC COM INP_2_2 INP_1_2 NC_03 NC_04 N021 N024 SI1_2_2 SI1_1_2 Gate2_VEE Kelvin2 Gate2_VCC N014 N016 N018 N022 DESAT2 COM 1EDI3035AS  ; pins VCC1 GND1 INP INN DATA_DECIMAL DATA NFLT RDY SI1 SI2 VEE2 GND2 VCC2 TON TOFF SOFTOFF GATE_CLAMP DESAT AIP_SASC
X§U3 LV_VCC COM INP_4_4 INP_3_4 NC_05 NC_06 N019 N023 SI1_4_4 SI1_3_4 Gate4_VEE Kelvin4 Gate4_VCC N013 N015 N017 N020 DESAT4 COM 1EDI3035AS  ; pins VCC1 GND1 INP INN DATA_DECIMAL DATA NFLT RDY SI1 SI2 VEE2 GND2 VCC2 TON TOFF SOFTOFF GATE_CLAMP DESAT AIP_SASC
X§U4 LV_VCC COM INP_3_3 INP_4_3 NC_07 NC_08 N007 N011 SI1_3_3 SI1_4_3 Gate3_VEE Kelvin3 Gate3_VCC N001 N003 N005 N008 DESAT3 COM 1EDI3035AS  ; pins VCC1 GND1 INP INN DATA_DECIMAL DATA NFLT RDY SI1 SI2 VEE2 GND2 VCC2 TON TOFF SOFTOFF GATE_CLAMP DESAT AIP_SASC
X§U5 V+ N010 V_OUT1 Kelvin1 IMDQ75R004M2H_L1 dvth={0} dvtdibl={0}  ; pins drain gate source source_k
X§U6 V_OUT1 N022 0 Kelvin2 IMDQ75R004M2H_L1 dvth={0} dvtdibl={0}  ; pins drain gate source source_k
X§U7 V+ N008 V_OUT2 Kelvin3 IMDQ75R004M2H_L1 dvth={0} dvtdibl={0}  ; pins drain gate source source_k
X§U8 V_OUT2 N020 0 Kelvin4 IMDQ75R004M2H_L1 dvth={0} dvtdibl={0}  ; pins drain gate source source_k
R29 V+ P001 5m
C15 P001 V_OUT1 .2µ
R47 V_OUT1 P002 5m
C14 P002 0 .2µ
R48 V_OUT2 P003 5m
C17 P003 0 .2µ
R49 V+ P004 5m
C19 P004 V_OUT2 .2µ
.model D D
.lib standard.dio
.options method=gear
.options noOpIter
.options gmin=1e-10
.options abstol=1e-9
.options reltol=0.01
.options cshunt=1e-15
.tran 0 5.1m 4.99m
.inc IFX_CoolSiC_Gen2_750V_Ind_obfuscated_wave1_3_4_6_LTSpice.lib
.inc 1EDI3035AS.lib
.inc C4AQOEW5800M3BJ_SPICE.CKT
.param period1 25u
.param t_on_h1 2u
.param t_on_l1 21u
.param cycles1 20
.param period2 25u
.param t_on_h2 10u
.param t_on_l2 13u
.param cycles2 20
.param R_g 1
.param R_softoff 20
.lib /Users/vladroiban/Documents/Inverter/LTSpice/1EDI3035AS.lib
.backanno
.end